# EAGLE design slush_cap_board_rev_d (EAGLE 8.5.0)
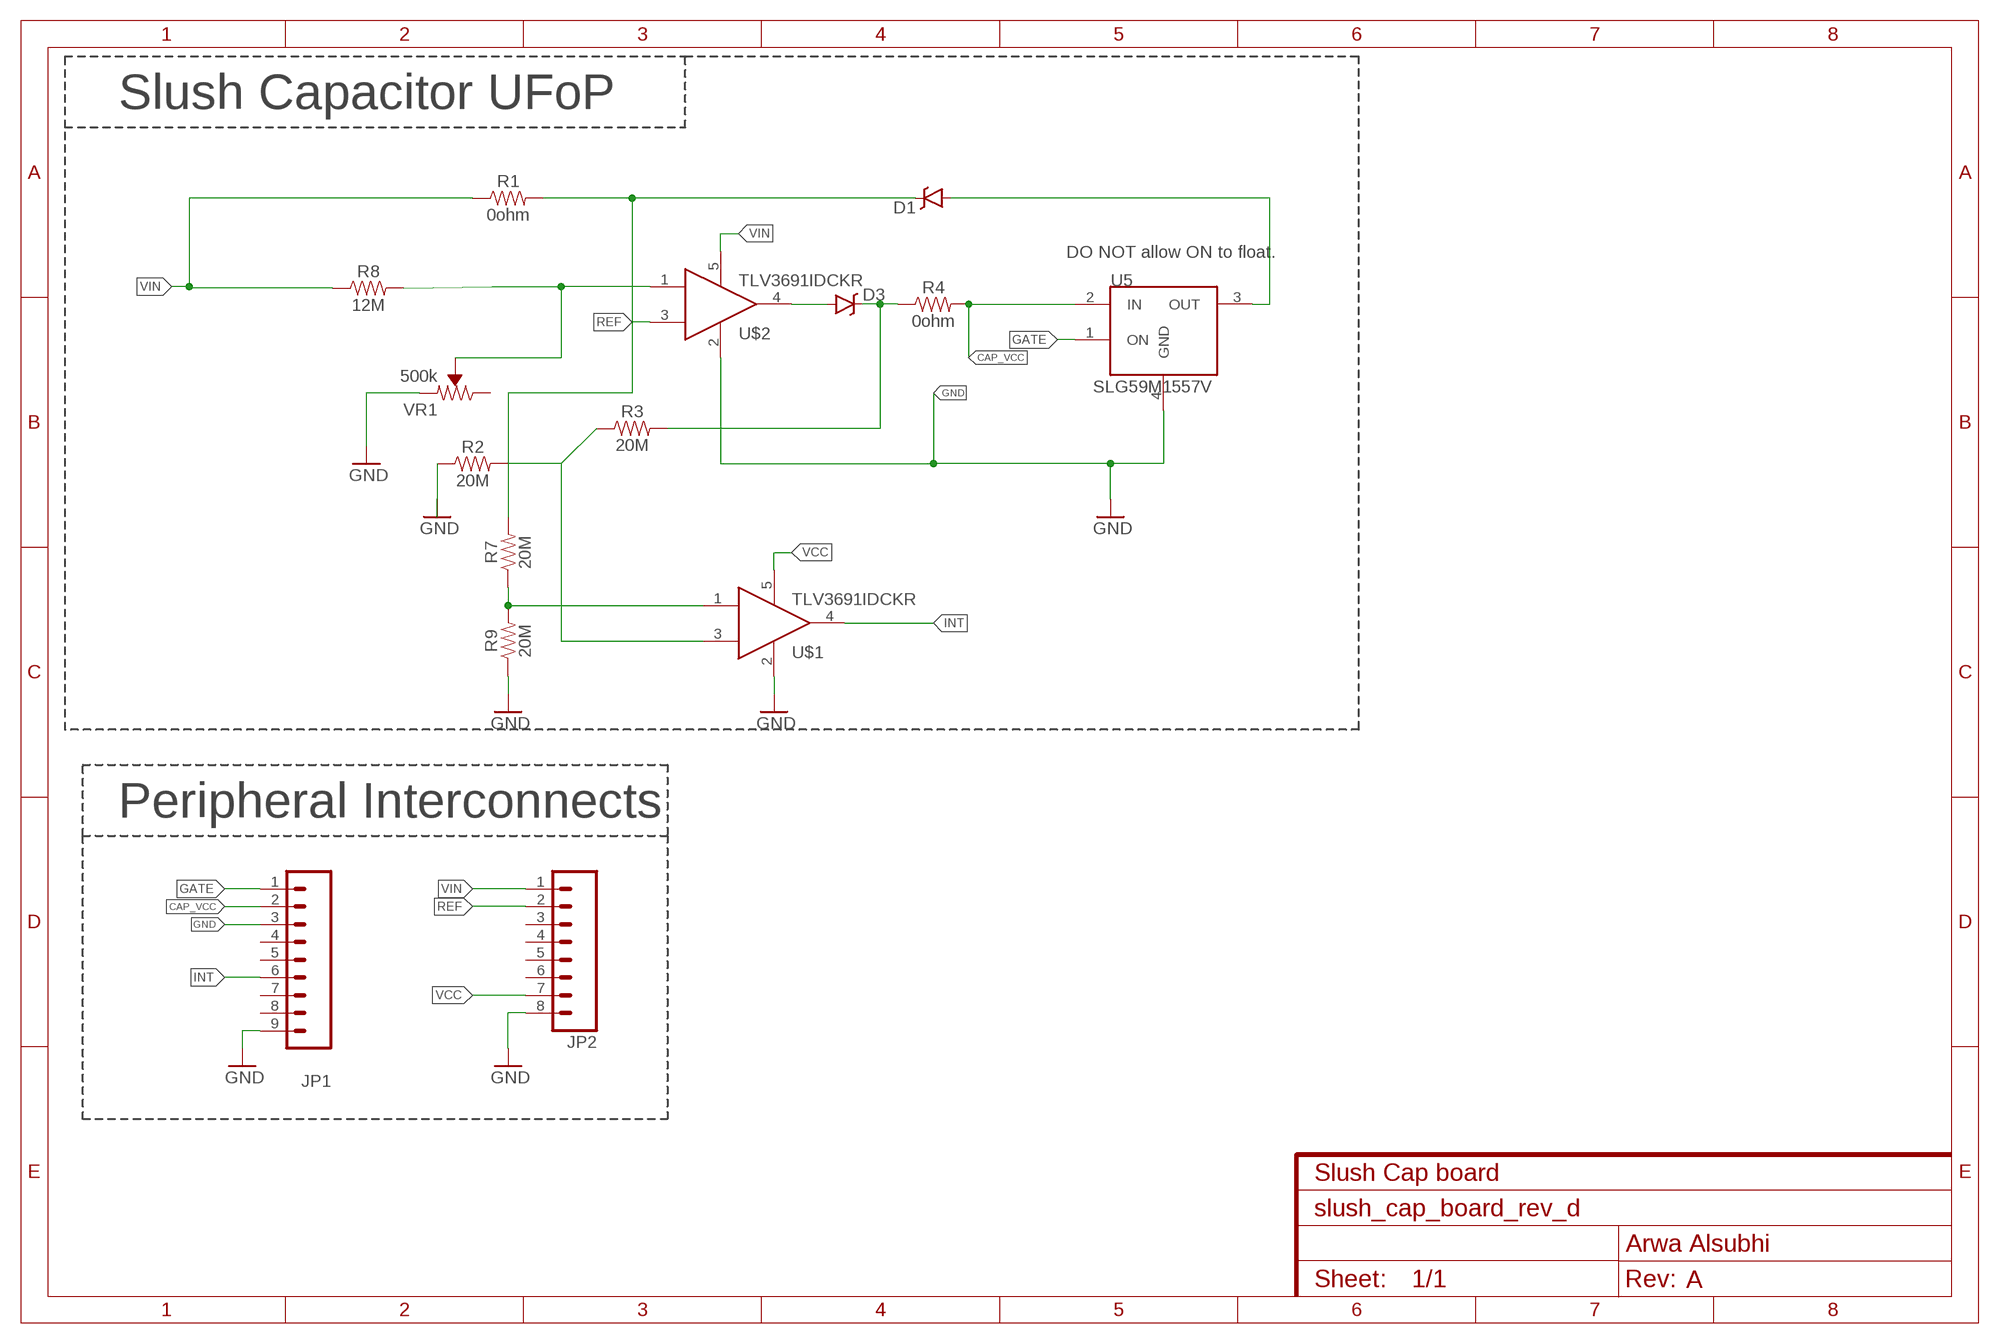
[diagram p0: schematic, sheet 1]
FRAME2 (FRAME-A4L): CNAME: Slush Cap board; CREVISION: A; DESIGNER: Arwa Alsubhi

## Parts
D1  RB751  DIODE-SCHOTTKY-RB751  [SOD-523]
D3  RB751  DIODE-SCHOTTKY-RB751  [SOD-523]
JP1  M091.27MM  [1X09-1.27MM]
JP2  M081.27MM  [1X08-1.27MM]
R1  0ohm  0603-RESISTOR-0603-1/10W-1%  [0603]
R2  20M  0.3OHM-0805-1/8W-1%  [0805]
R3  20M  0.3OHM-0805-1/8W-1%  [0805]
R4  0ohm  0603-RESISTOR-0603-1/10W-1%  [0603]
R7  20M  0.3OHM-0805-1/8W-1%  [0805]
R8  12M  0.3OHM-0805-1/8W-1%  [0805]
R9  20M  0.3OHM-0805-1/8W-1%  [0805]
U5  SLG59M1557V  [4STDFN]
U$1  TLV3691IDCKR  [SOT353]
U$2  TLV3691IDCKR  [SOT353]
VR1  500k  TRIMPOT-SMD-3MM-CLOSED-1/8W-20%  [TRIMPOT-SMD-3MM-CLOSED]

## Nets
CAP_VCC: JP1.2 R4.2 U5.2(IN)
GATE: JP1.1 U5.1(ON)
GND: JP1.3 JP1.9 JP2.8 R2.1 R9.1 U5.4(GND) U$1.2 U$2.2 VR1.1(CCW)
INT: JP1.6 U$1.4
N$1: D3.A U$2.4
N$2: D3.C R3.2 R4.1
N$3: D1.A U5.3(OUT)
N$4: R8.2 U$2.1 VR1.2(WIPER)
N$5: R2.2 R3.1 U$1.3
N$6: D1.C R1.2 R7.2
N$7: R7.1 R9.2 U$1.1
REF: JP2.2 U$2.3
VCC: JP2.7 U$1.5
VIN: JP2.1 R1.1 R8.1 U$2.5
Unconnected: JP1.4 JP1.5 JP1.7 JP1.8 JP2.3 JP2.4 JP2.5 JP2.6 VR1.3(CW)

## Notes on the sheet
- Slush Capacitor UFoP
- DO NOT allow ON to float.
- Peripheral Interconnects

## Library data of the parts
D1 D3 = SparkFun-DiscreteSemi:DIODE-SCHOTTKY: Schottky diodes in SFE's production catalog BAT20J 1A 23V 0.62Vf RB751 120mA 40V 0.37Vf PMEG4005EJ 0.5A 40V 0.42Vf MBRA140 1A 40V 0.5Vf B340A 3A 40V SMA; DIGIKEY: BAS40-02V-V-G-08GICT-ND; MPN: BAS40-02V-V-G-08; PROD_ID: DIO-11018
JP1 = SparkFun-Connectors:M09: Header 9 Standard 9-pin 0.1" header. Use with straight break away headers (SKU : PRT-00116), right angle break away headers (PRT-00553), swiss pins (PRT-00743), machine pins (PRT-00117), and female headers (PRT-00115).; DIGIKEY: S9014E-09-ND; MANUFACTURERPARTNUMBER: GRPB091VWVN-RC; MPN: GRPB091VWVN-RC
JP2 = SparkFun-Connectors:M08: Header 8 Standard 8-pin 0.1" header. Use with straight break away headers (SKU : PRT-00116), right angle break away headers (PRT-00553), swiss pins (PRT-00743), machine pins (PRT-00117), and female headers (PRT-00115).; DIGIKEY: S9014E-08-ND; MANUFACTURERPARTNUMBER: GRPB081VWVN-RC; MPN: GRPB081VWVN-RC
R1 R4 = Arwa_lib:0603-RESISTOR: resistor A resistor is a passive two-terminal electrical component that implements electrical resistance as a circuit element. Resistors act to reduce current flow, and, at the same time, act to lower voltage levels within circuits. - Wikipedia; PROD_ID: RES-08787
R2 R3 R7-R9 = SparkFun-Resistors:0.3OHM: 0.3Ω resistor A resistor is a passive two-terminal electrical component that implements electrical resistance as a circuit element. Resistors act to reduce current flow, and, at the same time, act to lower voltage levels within circuits. - Wikipedia; PROD_ID: RES-11622; VALUE: 0.3
U5 = loadswitches:SLG59M1557V: SILEGO SLG59M1557V: Ultra-small 28.5 mΩ, 1.0 A Integrated Power Switch with Discharge The SLG59M1557V is designed for load switching applications with ultra low quiescent current (20nA), and low turn on voltage (0.85V). The part comes with one 28.5 mΩ 1.0 A rated P-channel MOSFET controlled by a single ON control pin. The product is packaged in an ultra-small 1.0 x 1.0 mm package.; MANAFACTURER: SLG59M1557V; MOUSER: 402-SLG59M1557V; MPN: SLG59M1557V
U$1 U$2 = Arwa_lib:TLV3691IDCKR
VR1 = SparkFun-Resistors:TRIMPOT: Trimming Potentiometer (Trimpot) Three-terminal potentiometers, with an adjustable wiper and two adjustable resistors. A pot can be used to create a configurable voltage divider, or as a variable resistor. "Trimpots" are a subset of potentiometers, usually intended for "set-and-forget" applications. They're often more delicate than standard potentiometers - rated for fewer turns. Variants PTH-KNOB - PTH Trimpot w/ finger-adjustable knob Trimpot 10K with Knob <https://www.sparkfun.com/products/9806> (COM-09806) Datasheet <http://www.sparkfun.com/datasheets/Components/General/TSR-3386.pdf> SMD-3MM-CLOSED-FRAME - SMD 3mm Square Closed-Frame Trimpot Used on e.g. EasyDriver - Stepper Motor Driver <https://www.sparkfun.com/products/12779> Datasheet <http://www.bitechnologies.com/pdfs/22.pdf> (22AR10KTR) SMD-5MM - SMD 5mm Square Closed-Frame Trimpot Used on e.g. IOIO-OTG - V2.2 <https://www.sparkfun.com/products/13613> Datasheet <http://www.vishay.com/docs/51008/ts53.pdf> (TS53YL502MR10) SMD-3MM-1/10W-25% - 3mm Square Open-Frame Trimpot Used on e.g. SparkFun Shapeoko <https://www.sparkfun.com/products/13899> Datasheet <http://www.bourns.com/docs/Product-Datasheets/TC33.pdf> (TC33X-2-103E); PROD_ID: RES-09285; VALUE: 10k

## Board
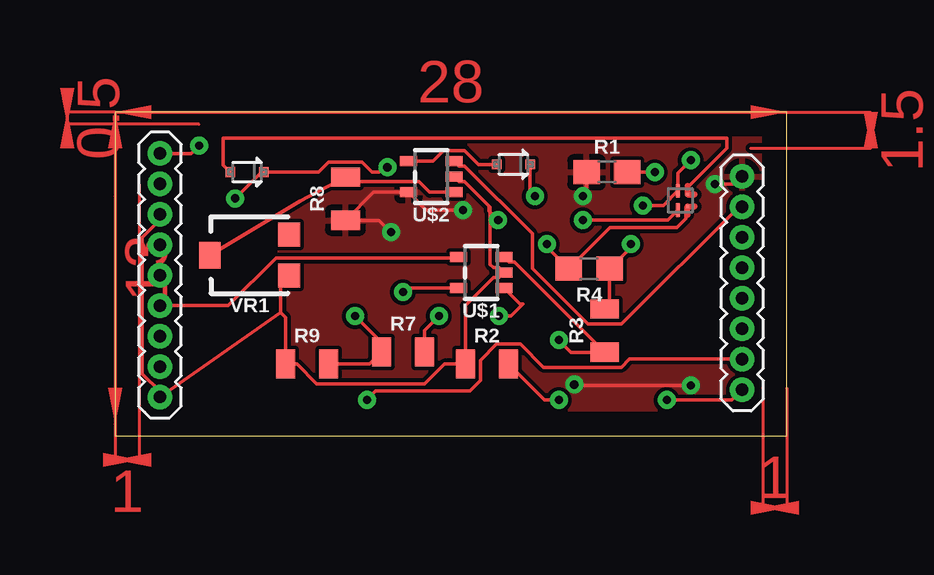
[diagram p1: board, top side]
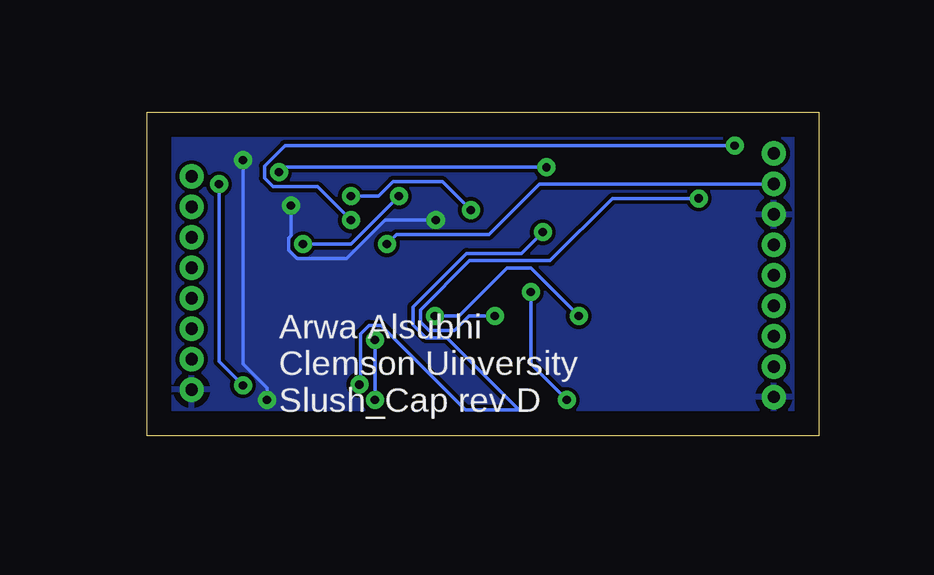
[diagram p2: board, bottom side, seen from below]

Size 28 x 13.5 mm. Coordinates in mm from the lower left corner, seen from the top.
Outline: 0,0 28,0 28,13.5 0,13.5 0,0
Copper layers (1*16): Top 0.035mm / dielectric 1.5mm / Bottom 0.035mm
Design rules "default": minimum track width 6mil, minimum drill 0.35mm, track to track 6mil, track to pad 6mil, pad to pad 6mil, via to via 6mil, smd to smd 6mil, copper to edge 40mil, drill to drill 6mil, minimum pad ring 10mil, minimum via ring 8mil, stop-mask expansion 4mil, vias tented up to drill 0mil, thermal gap 10mil

### Footprints (pad centres in the part's own frame; a part is rotated, then mirrored left to right if it is on the bottom)
SOD-523 = smd 0.4 x 0.4: A -0.7,0; C 0.7,0
1X09-1.27MM = drill 0.508 pad 1: 1 0,0; 2 1.27,0; 3 2.54,0; 4 3.81,0; 5 5.08,0; 6 6.35,0; 7 7.62,0; 8 8.89,0; 9 10.16,0
1X08-1.27MM = drill 0.508 pad 1: 1 0,0; 2 1.27,0; 3 2.54,0; 4 3.81,0; 5 5.08,0; 6 6.35,0; 7 7.62,0; 8 8.89,0
0603 = smd 1.1 x 1: 1 -0.85,0; 2 0.85,0
0805 = smd 0.8 x 1.2: 1 -0.9,0; 2 0.9,0
4STDFN = smd 0.6 x 0.2: 1 -0.4,0.1; 4 0.4,0.1 | smd 0.152 x 0.152: 2 -0.25,-0.3; 3 0.25,-0.3
SOT353 = smd 0.42 x 0.7: 1 -0.65,-0.95; 2 0,-0.95; 3 0.65,-0.95; 4 0.65,0.95; 5 -0.65,0.95
TRIMPOT-SMD-3MM-CLOSED = smd 1 x 0.9: 1 -0.85,-1.65; 3 0.85,-1.65 | smd 1.1 x 0.9: 2 0,1.65

### Placement (x,y rotation side)
D1  5.5,11 0 top
D3  16.6,11.32 0 top
JP1  1.87,11.78 270 top
JP2  26.14,10.82 270 top
R1  20.5,11 0 top
R2  15.5,3 0 top
R3  20.41,4.39 90 top
R4  19.76,6.97 180 top
R7  12,3.5 0 top
R8  9.6,9.89 90 top
R9  8,3 0 top
U5  23.56,9.82 90 top
U$1  15.26,6.81 90 top
U$2  13.18,10.81 90 top
VR1  5.6,7.54 90 top

### Tracks (layer width: path | path; a pad name or v marks a point on that pad's centre or on a via)
CAP_VCC  (via drill 0.35)
  Top 0.152: v18,8 18,7.88 R4.2 20.64,8.7 23.43,8.7 23.79,9.06 23.79,9.5 U5.2
  Bottom 0.152: v18,8 17.61,8.39 13.75,8.39 11.63,10.51 JP1.2
GATE  (via drill 0.35)
  Top 0.152: JP1.1 3.17,11.78 v3.5,12.11 | v19.5,9 23.04,9 U5.1
  Bottom 0.152: v19.5,9 20.89,10.39 22.75,10.39 23.11,10.75 23.11,11.25 22.25,12.11 v3.5,12.11
GND  (via drill 0.35)
  Top 0.152: 6.89,5.16 JP1.9 1.87,1.85 1.13,2.58 1.13,8.28 1.87,9.01 JP1.3 | 6.89,5.16 7.1,4.95 R9.1 7.58,3 8.4,2.17 12.89,2.17 13.72,3 R2.1 14.6,5.43 15.77,6.6 16,6.6 U$1.2 16,7.02 15.77,7.02 15.63,7.16 15.63,9.54 15.59,9.59 | U$2.2 14.34,10.6 14.57,10.6 15.59,9.59 | v23,1.5 25.71,1.5 JP2.8 | v24,11.5 23.46,10.96 U5.4 22.85,9.61 v22,9.61 | VR1.1 6.89,6.33 6.89,5.16 | 15.59,9.59 15.59,9.38 v15.96,9
  Bottom 0.152: v24,11.5 24,3 23,2 v23,1.5 | v15.96,9 18.07,9 19.68,7.39 21.75,7.39 22.11,7.75 22.11,8.25 22,8.36 v22,9.61
  pour Bottom: 0,14 28,14 28,0 0,0
INT
  Top 0.152: JP1.6 4.72,5.43 6.71,7.42 14.27,7.42 U$1.4
N$1
  Top 0.152: D3.A 15.15,11.32 14.57,11.9 13.69,11.9 13.25,11.46 U$2.4
N$2  (via drill 0.35)
  Top 0.152: R3.2 20.61,5.49 R4.1 21.5,7.86 v21.5,8 | v17.5,10 17.3,10.2 D3.C
  Bottom 0.152: v21.5,8 19.5,8 v17.5,10
N$3
  Top 0.152: U5.3 23.86,10.36 25.5,12 25.5,12.41 4.5,12.41 4.5,11.3 D1.A
N$4
  Top 0.152: U$2.1 13.11,10.16 12.68,10.6 9.79,10.6 R8.2 7.7,9.79 VR1.2
N$5  (via drill 0.35)
  Top 0.152: U$1.3 16.42,7.25 16.66,7.25 16.79,7.12 16.79,7.11 R3.1 19.01,3.49 v18.5,4 | v18.5,1.5 17.9,1.5 R2.2
  Bottom 0.152: v18.5,4 v18.5,1.5
N$6  (via drill 0.35)
  Top 0.152: v11.35,11.21 11.21,11.21 11,11 10.71,11 10.29,11.42 8.9,11.42 8.49,11 D1.C 6.1,11 v5,9.9 | v22.5,11 R1.2 | v13.5,5 12.9,4.4 R7.2
  Bottom 0.152: v11.35,11.21 22.3,11.21 v22.5,11 | v5,9.9 8.6,9.9 11.2,7.3 14.55,7.3 16.61,5.25 16.61,4.75 16.25,4.39 15.18,4.39 14.57,5 v13.5,5
N$7  (via drill 0.35)
  Top 0.152: R9.2 10.6,3 11.05,3.45 | 11.05,3.45 R7.1 | U$1.1 16.87,5.5 17,5.5 16.5,5 v16,5 | v10,5 11.05,3.95 11.05,3.45
  Bottom 0.152: v16,5 15,5 13,7 12,7 v10,5
REF
  Top 0.152: U$2.3 14.34,11.25 14.57,11.25 17.39,8.43 17.39,6.98 19.71,4.66 21.11,4.66 25.99,9.55 JP2.2
VCC  (via drill 0.35)
  Top 0.152: v10.5,1.5 10.87,1.87 14.79,1.87 15.23,2.31 15.23,3.15 15.9,3.83 16.89,3.83 17.86,2.86 21.11,2.86 21.44,3.2 JP2.7 | v12,6 12.16,6.16 U$1.5
  Bottom 0.152: v10.5,1.5 12,3 v12,6
VIN  (via drill 0.35)
  Top 0.152: v14.5,9.42 12.97,9.42 U$2.5 10.77,10.16 R8.1 11.01,8.99 v11.5,8.5 | v19.5,10 19.65,10.15 R1.1 | JP2.1 25.82,10.5 v25,10.5 | v24,2.11 19.18,2.11 v19.14,2.14
  Bottom 0.152: v19.5,10 18.36,10 17.75,10.61 15.69,10.61 v14.5,9.42 | v25,10.5 25,3.11 v24,2.11 | v19.14,2.14 19.11,2.18 19.11,4.25 18.75,4.61 18.25,4.61 14.73,1.09 12.5,1.09 15.5,4.09 16.38,4.09 16.91,4.62 16.91,5.38 14.68,7.61 12.39,7.61 v11.5,8.5
  pour Top: 0,14 28,14 28,-0.5 0,-0.5
(copper drawn outside any net)
  shapes: Top area x6

### Text on the board
bNames: Arwa Alsubhi / Clemson Uinversity / Slush_Cap rev D